# Altium project ISL6236A_DEMO_V1I1.PrjPcb
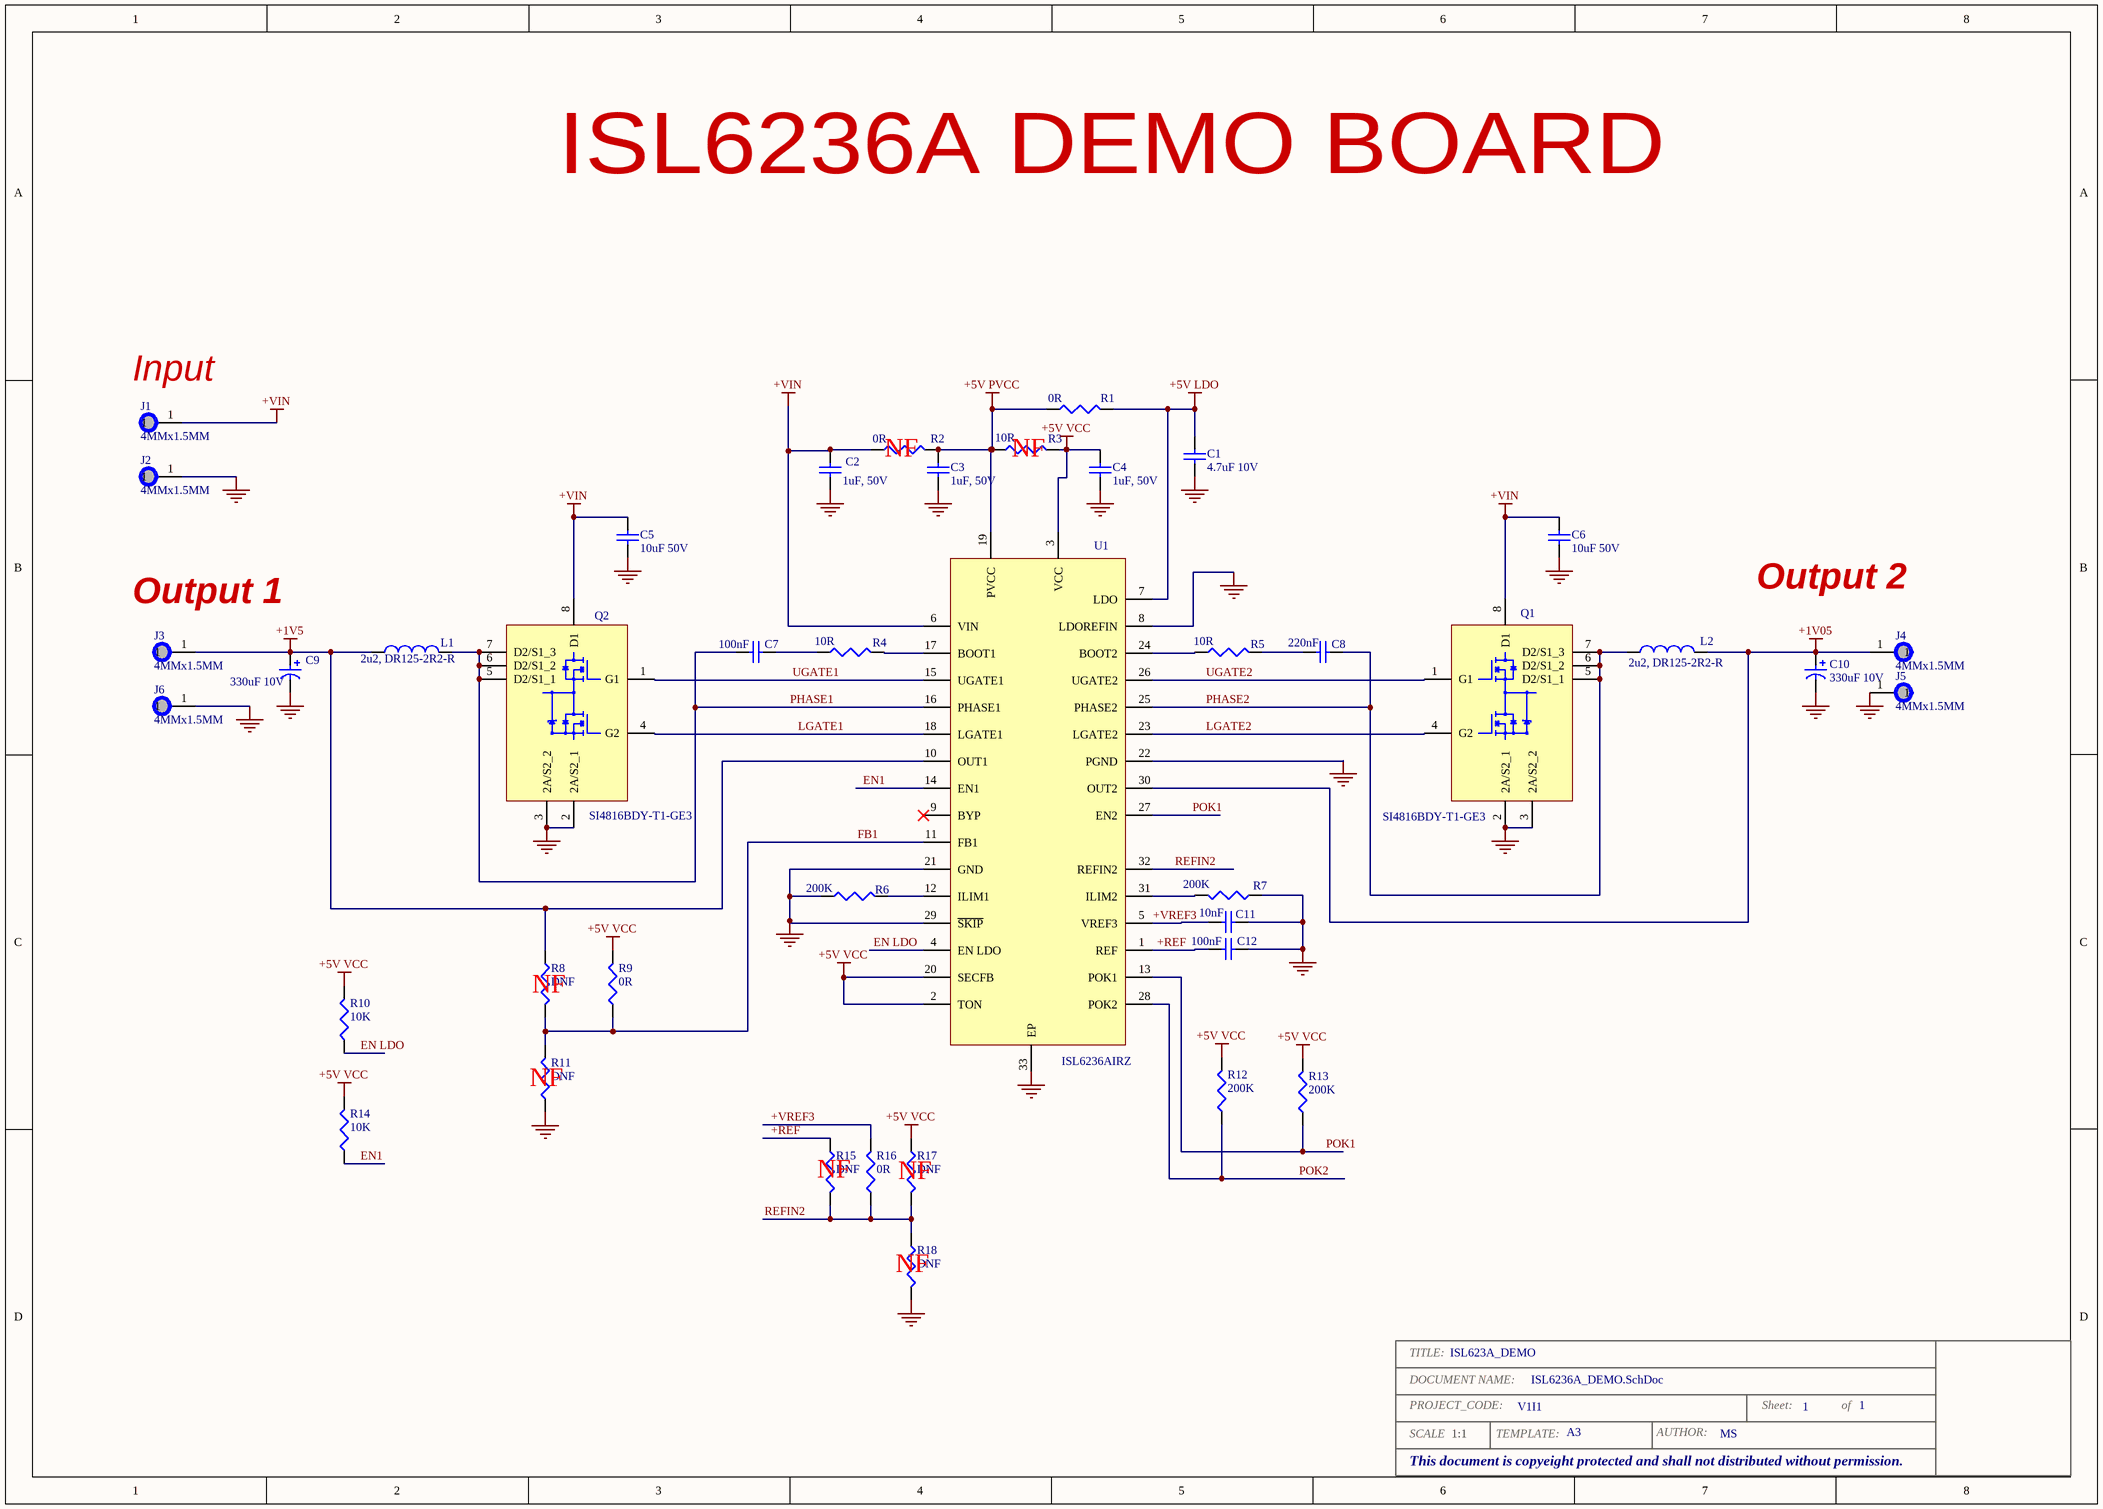
[diagram p0: ISL6236A_DEMO.SchDoc]
1 sheet, 42 parts. Net scope: global (net labels, ports and power ports of the same name join across sheets).
Board file: ISL6236A_DEMO.PcbDoc

## Sheet ISL6236A_DEMO.SchDoc: ISL623A_DEMO
size A3; Author: MS; DocumentNumber: 1; Revision: V1I1; SheetNumber: 1; SheetTotal: 1

### Parts
?  TEMPLATE: A3  (hidden comment: TitleBlock)  (graphical)
C1  4.7uF 10V  [C1210]
C2  1uF, 50V  [C0805]
C3  1uF, 50V  [C0805]
C4  1uF, 50V  [C0805]
C5  10uF 50V  [C1210]
C6  10uF 50V  [C1210]
C7  100nF  [C0805]
C8  220nF  [C0805]
C9  330uF 10V  [7343-43]
C10  330uF 10V  [7343-43]
C11  10nF  [C0805]
C12  100nF  [C0805]
J1  4MMx1.5MM  [PAD_WITH_HOLE_4MMx1.5MM]
J2  4MMx1.5MM  [PAD_WITH_HOLE_4MMx1.5MM]
J3  4MMx1.5MM  [PAD_WITH_HOLE_4MMx1.5MM]
J4  4MMx1.5MM  [PAD_WITH_HOLE_4MMx1.5MM]
J5  4MMx1.5MM  [PAD_WITH_HOLE_4MMx1.5MM]
J6  4MMx1.5MM  [PAD_WITH_HOLE_4MMx1.5MM]
L1  2u2, DR125-2R2-R  [DR125]
L2  2u2, DR125-2R2-R  [DR125]
Q1  SI4816BDY-T1-GE3  [SO-8]
Q2  SI4816BDY-T1-GE3  [SO-8]
R1  0R  [R0805]
R2  0R  [R0805]
R3  10R  [R0805]
R4  10R  [R0805]
R5  10R  [R0805]
R6  200K  [R0805]
R7  200K  [R0805]
R8  DNF  [R0805]
R9  0R  [R0805]
R10  10K  [R0805]
R11  DNF  [R0805]
R12  200K  [R0805]
R13  200K  [R0805]
R14  10K  [R0805]
R15  DNF  [R0805]
R16  0R  [R0805]
R17  DNF  [R0805]
R18  DNF  [R0805]
U1  ISL6236AIRZ  [LL32.5x5B]

### Nets
+1V5: C9.1 J3.1 L1.1 R8.1 U1.10(OUT1)
+1V05: C10.1 J4.1 L2.2 U1.30(OUT2)
+5V LDO: C1.2 R1.2 U1.7(LDO)
+5V PVCC: C3.2 R1.1 R2.2 R3.1 U1.19(PVCC)
+5V VCC: C4.2 R3.2 R9.2 R10.2 R12.2 R13.2 R14.2 R17.1 U1.2(TON) U1.3(VCC) U1.20(SECFB)
+VIN: C2.2 C5.2 C6.2 J1.1 Q1.8(D1) Q2.8(D1) R2.1 U1.6(VIN)
GND: C1.1 C2.1 C3.1 C4.1 C5.1 C6.1 C9.2 C10.2 C11.2 C12.2 J2.1 J5.1 J6.1 Q1.2(2A/S2_1) Q1.3(2A/S2_2) Q2.2(2A/S2_1) Q2.3(2A/S2_2) R6.2 R7.1 R11.1 R18.2 U1.8(LDOREFIN) U1.21(GND) U1.22(PGND) U1.29(~{SKIP}) U1.33(EP)
+REF: C12.1 R15.1 U1.1(REF)
+VREF3: C11.1 R16.2 U1.5(VREF3)
EN1: R14.1 U1.14(EN1)
EN LDO: R10.1 U1.4(EN_LDO)
FB1: R8.2 R9.1 R11.2 U1.11(FB1)
LGATE1: Q2.4(G2) U1.18(LGATE1)
LGATE2: Q1.4(G2) U1.23(LGATE2)
PHASE1: C7.1 L1.2 Q2.5(D2/S1_1) Q2.6(D2/S1_2) Q2.7(D2/S1_3) U1.16(PHASE1)
PHASE2: C8.2 L2.1 Q1.5(D2/S1_1) Q1.6(D2/S1_2) Q1.7(D2/S1_3) U1.25(PHASE2)
POK1: R13.1 U1.13(POK1) U1.27(EN2)
POK2: R12.1 U1.28(POK2)
REFIN2: R15.2 R16.1 R17.2 R18.1 U1.32(REFIN2)
UGATE1: Q2.1(G1) U1.15(UGATE1)
UGATE2: Q1.1(G1) U1.26(UGATE2)
NetC7_2: C7.2 R4.1
NetC8_1: C8.1 R5.2
NetR4_2: R4.2 U1.17(BOOT1)
NetR5_1: R5.1 U1.24(BOOT2)
NetR6_1: R6.1 U1.12(ILIM1)
NetR7_2: R7.2 U1.31(ILIM2)

Not connected (* = marked no-connect by the designer): U1 9(BYP)*

### Notes on the sheet
- ISL6236A DEMO BOARD
- (near J1) Input
- (near R2) NF
- (near R3) NF
- Output 1
- Output 2
- (near R8) NF
- (near R11) NF
- (near R15) NF
- (near R17) NF
- (near R18) NF
- (in symbol TitleBlock) TITLE:; DOCUMENT NAME:; PROJECT_CODE:; Sheet:; of; SCALE; 1:1; TEMPLATE:; AUTHOR:; This document is copyeight protected and shall not distributed without permission.

### Library data of the parts
? = TitleBlock: Standard Title Block
C1 = C3225X7R1H105M/2.00: Cap Ceramic 1uF 50V X7R 20% SMD 1210 125°C Blister T/R; Manufacturer: TDK; Supplier 1: Newark; Manufacturer Part Number: C3225X7R1H105M/2.00; RoHS: Yes; Category: Ceramic Capacitors; Mount: Surface Mount; Case/Package: 1210; Number of Pins: 2; Case Code (Metric): 3225; Case Code (Imperial): 1210; Min Operating Temperature: -55°C; Max Operating Temperature: 125°C; Capacitance: 1uF; Voltage Rating: 50V; Tolerance: 20%; Packaging: Tape and Reel; Dielectric: X7R; Package Quantity: 1; Voltage Rating (DC): 50V; Series: C; Construction: Flat; Length: 0.126inch; Width: 0.098inch; Thickness: 0.087inch; RoHS Compliant: Yes; ComponentLink1URL: https://datasheet.ciiva.com/162/c-series-generalappl-b11-162224.pdf?src-supplier=Digi-Key; ComponentLink1Description: https://datasheet.ciiva.com/162/c-series-generalappl-b11-162224.pdf?src-supplier=Digi-Key; ComponentLink2URL: https://datasheet.ciiva.com/162/c-series-generalappl-b11-162225.pdf?src-supplier=Digi-Key; ComponentLink2Description: https://datasheet.ciiva.com/162/c-series-generalappl-b11-162225.pdf?src-supplier=Digi-Key; ComponentLink3URL: https://datasheet.ciiva.com/162/c-series-generalappl-b11-162223.pdf?src-supplier=Digi-Key; ComponentLink3Description: https://datasheet.ciiva.com/162/c-series-generalappl-b11-162223.pdf?src-supplier=Digi-Key; Supplier Part Number 1: 48T2930
C2-C4 = C2012X7R1H105K125AB: C Series 0805 1 uF 50 V ±10% Tolerance X7R SMT Multilayer Ceramic Capacitor; Manufacturer: TDK; Supplier 1: Newark; Manufacturer Part Number: C2012X7R1H105K125AB; RoHS: Yes; Category: Ceramic Capacitors; Stock 1: 428000; Pricing 1: 1=0.07800, 2000=0.07500, 4000=0.07300 (USD); Mount: Surface Mount; Case/Package: 0805; Number of Pins: 2; Case Code (Metric): 2012; Case Code (Imperial): 0805; Weight: 0.000194oz; Dielectric Material: Ceramic; Min Operating Temperature: -55°C; Max Operating Temperature: 125°C; Packaging: Tape and Reel; Package Quantity: 1; Capacitance: 1uF; Tolerance: 10%; Voltage Rating: 50V; Voltage Rating (DC): 50V; Dielectric: X7R; Termination: SMD/SMT; Resistor Type: Ceramic; Series: C; Construction: Flat; Length: 2mm; Width: 0.049inch; Height: 1.25mm; Thickness: 0.057inch; Depth: 1.25mm; Radiation Hardening: No; REACH SVHC: No SVHC; Lead Free: Lead Free; RoHS Compliant: Yes; ComponentLink1URL: https://datasheet.ciiva.com/22718/1796654-22718037.pdf?src-supplier=Element14; ComponentLink1Description: https://datasheet.ciiva.com/22718/1796654-22718037.pdf?src-supplier=Element14; ComponentLink2URL: https://datasheet.ciiva.com/6274/tdkmlcccaprange-6274890.pdf?src-supplier=Digi-Key; ComponentLink2Description: https://datasheet.ciiva.com/6274/tdkmlcccaprange-6274890.pdf?src-supplier=Digi-Key; ComponentLink3URL: https://datasheet.ciiva.com/23803/1796654-23803036.pdf?src-supplier=Newark; ComponentLink3Description: https://datasheet.ciiva.com/23803/1796654-23803036.pdf?src-supplier=Newark; ComponentLink4URL: https://datasheet.ciiva.com/28673/mlcc-commercial-general-en-28673565.pdf?src-supplier=Element14; ComponentLink4Description: https://datasheet.ciiva.com/28673/mlcc-commercial-general-en-28673565.pdf?src-supplier=Element14; ComponentLink5URL: https://datasheet.ciiva.com/6274/tdkmlcccaprange-6274886.pdf?src-supplier=Digi-Key; ComponentLink5Description: https://datasheet.ciiva.com/6274/tdkmlcccaprange-6274886.pdf?src-supplier=Digi-Key; ComponentLink6URL: https://datasheet.ciiva.com/6274/tdkmlcccaprange-6274888.pdf?src-supplier=Digi-Key; ComponentLink6Description: https://datasheet.ciiva.com/6274/tdkmlcccaprange-6274888.pdf?src-supplier=Digi-Key; ComponentLink7URL: https://datasheet.ciiva.com/24191/general-b11-24191449.pdf?src-supplier=Future+Electronics; ComponentLink7Description: https://datasheet.ciiva.com/24191/general-b11-24191449.pdf?src-supplier=Future+Electronics; Supplier Part Number 1: 79Y4372
C5 C6 = UMK325BJ106MM-T: Multilayer Ceramic Capacitors (High dielectric type), 50V, 10 uF, ± 20 %, 1210, X5R, RoHS; Manufacturer: Taiyo Yuden; Tolerance: 20%; Supplier 1: Avnet; Manufacturer Part Number: UMK325BJ106MM-T; RoHS: Yes; Category: Ceramic Capacitors; Stock 1: 1500; Pricing 1: 500=0.25400, 1000=0.23400, 2000=0.22800, 3000=0.22100, 5000=0.21000 (USD); Mount: Surface Mount; Case/Package: 1210; Number of Pins: 2; Case Code (Metric): 3225; Case Code (Imperial): 1210; Contact Plating: Nickel; Min Operating Temperature: -55°C; Max Operating Temperature: 85°C; Capacitance: 10uF; Packaging: Tape and Reel; Voltage Rating (DC): 50V; Dielectric: X5R; Package Quantity: 500; Voltage Rating: 50V; Termination: SMD/SMT; Voltage: 50V; Series: M; Construction: Flat; Length: 3.2mm; Width: 0.098inch; Height: 2.5mm; Thickness: 0.106inch; Depth: 2.5mm; Radiation Hardening: No; Lead Free: Lead Free; Halogen Free: Halogen Free; REACH SVHC: No SVHC; RoHS Compliant: Yes; ComponentLink1URL: https://datasheet.ciiva.com/141/umk325bj106mm-t-ss-141730.pdf?src-supplier=Digi-Key; ComponentLink1Description: https://datasheet.ciiva.com/141/umk325bj106mm-t-ss-141730.pdf?src-supplier=Digi-Key; ComponentLink2URL: https://datasheet.ciiva.com/15922/1153umk325bj106mm-t-15922661.pdf?src-supplier=Onlinecomponents.com; ComponentLink2Description: https://datasheet.ciiva.com/15922/1153umk325bj106mm-t-15922661.pdf?src-supplier=Onlinecomponents.com; ComponentLink3URL: https://datasheet.ciiva.com/11601/umk325bj106mm-t-ss-11601831.pdf?src-supplier=Avnet; ComponentLink3Description: https://datasheet.ciiva.com/11601/umk325bj106mm-t-ss-11601831.pdf?src-supplier=Avnet; ComponentLink4URL: https://datasheet.ciiva.com/30172/998umk325bj106mm-t-30172061.pdf?src-supplier=Onlinecomponents.com; ComponentLink4Description: https://datasheet.ciiva.com/30172/998umk325bj106mm-t-30172061.pdf?src-supplier=Onlinecomponents.com; ComponentLink5URL: https://datasheet.ciiva.com/7975/1497285-7975925.pdf?src-supplier=Element14; ComponentLink5Description: https://datasheet.ciiva.com/7975/1497285-7975925.pdf?src-supplier=Element14; ComponentLink6URL: https://datasheet.ciiva.com/7975/mlcc-all-e-7975926.pdf?src-supplier=Element14; ComponentLink6Description: https://datasheet.ciiva.com/7975/mlcc-all-e-7975926.pdf?src-supplier=Element14; ComponentLink7URL: https://datasheet.ciiva.com/5745/mlcc-all-e-5745129.pdf?src-supplier=Farnell; ComponentLink7Description: https://datasheet.ciiva.com/5745/mlcc-all-e-5745129.pdf?src-supplier=Farnell; ComponentLink8URL: https://datasheet.ciiva.com/5744/1497285-5744924.pdf?src-supplier=Farnell; ComponentLink8Description: https://datasheet.ciiva.com/5744/1497285-5744924.pdf?src-supplier=Farnell; Supplier Part Number 1: 61M4721
C7 C12 = C2012X7R1H104K085AA: C Series 0805 0.1 uF 50 V ±10 % Tolerance X7R SMT Multilayer Ceramic Capacitor; Manufacturer: TDK; Voltage Rating: 50V; Tolerance: 10%; Supplier 1: Digi-Key; Manufacturer Part Number: C2012X7R1H104K085AA; RoHS: Yes; Category: Ceramic Capacitors; Stock 1: 4695; Pricing 1: 1=0.15000, 10=0.10400, 50=0.05900, 100=0.04880, 500=0.03422, 1000=0.02833 (USD); Mount: Surface Mount; Case/Package: 0805; Number of Pins: 2; Case Code (Metric): 2012; Case Code (Imperial): 0805; Weight: 0.000194oz; Dielectric Material: Ceramic; Min Operating Temperature: -55°C; Max Operating Temperature: 125°C; Package Quantity: 1; Packaging: Tape and Reel; Capacitance: 100nF; Voltage Rating (DC): 50V; Dielectric: X7R; Termination: SMD/SMT; Resistor Type: Ceramic; Voltage: 50V; Series: C; Construction: Flat; Length: 2mm; Width: 0.049inch; Height: 0.85mm; Thickness: 0.037inch; Depth: 1.25mm; Radiation Hardening: No; REACH SVHC: No SVHC; Lead Free: Lead Free; RoHS Compliant: Yes; ComponentLink1URL: https://datasheet.ciiva.com/11788/0900766b80c1bb00-11788128.pdf?src-supplier=RSComponents; ComponentLink1Description: https://datasheet.ciiva.com/11788/0900766b80c1bb00-11788128.pdf?src-supplier=RSComponents; ComponentLink2URL: https://datasheet.ciiva.com/6250/tdkmlcccaprange-6250821.pdf?src-supplier=Digi-Key; ComponentLink2Description: https://datasheet.ciiva.com/6250/tdkmlcccaprange-6250821.pdf?src-supplier=Digi-Key; ComponentLink3URL: https://datasheet.ciiva.com/24191/e412-c-24191447.pdf?src-supplier=Future+Electronics; ComponentLink3Description: https://datasheet.ciiva.com/24191/e412-c-24191447.pdf?src-supplier=Future+Electronics; ComponentLink4URL: https://datasheet.ciiva.com/6250/tdkmlcccaprange-6250824.pdf?src-supplier=Digi-Key; ComponentLink4Description: https://datasheet.ciiva.com/6250/tdkmlcccaprange-6250824.pdf?src-supplier=Digi-Key; ComponentLink5URL: https://datasheet.ciiva.com/23803/1796654-23803035.pdf?src-supplier=Newark; ComponentLink5Description: https://datasheet.ciiva.com/23803/1796654-23803035.pdf?src-supplier=Newark; ComponentLink6URL: https://datasheet.ciiva.com/28602/1571323-28602204.pdf?src-supplier=Element14; ComponentLink6Description: https://datasheet.ciiva.com/28602/1571323-28602204.pdf?src-supplier=Element14; Supplier Part Number 1: 445-7534-1-ND
C8 = C2012X7R1H224K125AA: CERAMIC CAPACITOR 0.22UF, 50V, X7R, 10%, 0805, FULL REEL; Product Range:C Series; Capacitance:0.22 F; Capacitance Tolerance:  10%; Dielectric Characteristic:X7R; Voltage Rating:50V; Ceramic Capacitor Case:0805 ^2012 Metric]; MSL:-; Manufacturer: TDK; Supplier 1: Digi-Key; Manufacturer Part Number: C2012X7R1H224K125AA; RoHS: Yes; Category: Ceramic Capacitors; Stock 1: 191329; Pricing 1: 1=0.16000, 10=0.11600, 50=0.06580, 100=0.05450, 500=0.03824, 1000=0.03166 (USD); Mount: Surface Mount; Case/Package: 0805; Number of Pins: 2; Case Code (Metric): 2012; Case Code (Imperial): 0805; Weight: 0.000194oz; Dielectric Material: Ceramic; Min Operating Temperature: -55°C; Max Operating Temperature: 125°C; Capacitance: 220nF; Voltage Rating: 50V; Tolerance: 10%; Packaging: Tape and Reel; Package Quantity: 1; Voltage Rating (DC): 50V; Dielectric: X7R; Termination: SMD/SMT; Resistor Type: Ceramic; Voltage: 50V; Series: C; Construction: Flat; Length: 2mm; Width: 0.049inch; Height: 1.25mm; Thickness: 0.057inch; Depth: 1.25mm; Radiation Hardening: No; REACH SVHC: No SVHC; Lead Free: Lead Free; RoHS Compliant: Yes; ComponentLink1URL: https://datasheet.ciiva.com/11788/0900766b80c1bb00-11788127.pdf?src-supplier=RSComponents; ComponentLink1Description: https://datasheet.ciiva.com/11788/0900766b80c1bb00-11788127.pdf?src-supplier=RSComponents; ComponentLink2URL: https://datasheet.ciiva.com/17487/e412-c-17487255.pdf?src-supplier=Avnet+Europe; ComponentLink2Description: https://datasheet.ciiva.com/17487/e412-c-17487255.pdf?src-supplier=Avnet+Europe; ComponentLink3URL: https://datasheet.ciiva.com/6292/tdkmlcccaprange-6292269.pdf?src-supplier=Digi-Key; ComponentLink3Description: https://datasheet.ciiva.com/6292/tdkmlcccaprange-6292269.pdf?src-supplier=Digi-Key; ComponentLink4URL: https://datasheet.ciiva.com/16427/e412-c-16427832.pdf?src-supplier=Future+Electronics; ComponentLink4Description: https://datasheet.ciiva.com/16427/e412-c-16427832.pdf?src-supplier=Future+Electronics; ComponentLink5URL: https://datasheet.ciiva.com/28602/1571323-28602205.pdf?src-supplier=Element14; ComponentLink5Description: https://datasheet.ciiva.com/28602/1571323-28602205.pdf?src-supplier=Element14; Supplier Part Number 1: 445-1350-1-ND
C9 C10 = T530X337M010ATE004: Cap Tant Solid 330uF 10V X CASE 20% (7.3 X 4.3 X 4mm) SMD 7343-43 0.004 Ohm 125 C T/R; Manufacturer: KEMET; ESR (Equivalent Series Resistance): 4mR; Leakage Current: 330uA; Polarity: Polar; Dissipation Factor: 8%; Ripple Current: 8.2A; Life (Hours): 2000Hour; Supplier 1: Digi-Key; Manufacturer Part Number: T530X337M010ATE004; RoHS: Yes; Category: Polymer Capacitors; Stock 1: 41; Pricing 1: 1=8.13000, 10=7.23000, 50=6.32620, 100=5.78400 (USD); Mount: Surface Mount,PCB; Case/Package: 2917; Case Code (Imperial): 2917; Case Code (Metric): 7343; Min Operating Temperature: -55°C; Max Operating Temperature: 125°C; Capacitance: 330uF; Tolerance: 20%; Package Quantity: 500; Voltage Rating (DC): 10V; Packaging: Tape and Reel; Voltage Rating: 10V; Termination: SMD/SMT; Features: General Purpose; Series: T530; Construction: Flat; Voltage: 10V; Length: 7.3mm; Width: 4.3mm; Height: 4mm; Depth: 4.3mm; Height - Seated (Max): 0.169inch; REACH SVHC: No SVHC; RoHS Compliant: Yes; ComponentLink1URL: https://datasheet.ciiva.com/11794/0900766b80deaa91-11794477.pdf?src-supplier=RSComponents; ComponentLink1Description: https://datasheet.ciiva.com/11794/0900766b80deaa91-11794477.pdf?src-supplier=RSComponents; ComponentLink2URL: https://datasheet.ciiva.com/14593/70096008-14593753.pdf?src-supplier=Allied+Electronics; ComponentLink2Description: https://datasheet.ciiva.com/14593/70096008-14593753.pdf?src-supplier=Allied+Electronics; Supplier Part Number 1: 399-10378-1-ND
C11 = VJ0805Y103KNAAO: 0805 VJ 10nF Ceramic Multilayer Capacitor; 50V; +105C; X7R Dielectric; +/-10% SMD; Manufacturer: Vishay Vitramon; Tolerance: 10%; Supplier 1: Digi-Key; Manufacturer Part Number: VJ0805Y103KNAAO; RoHS: Yes; Category: Ceramic Capacitors; Stock 1: 1009; Pricing 1: 1=0.67000, 10=0.41200, 50=0.29580, 100=0.25580, 500=0.18218, 1000=0.15504 (USD); Mount: Surface Mount; Case/Package: 0805; Case Code (Metric): 2012; Case Code (Imperial): 0805; Min Operating Temperature: -55°C; Max Operating Temperature: 125°C; Packaging: Tape and Reel; Capacitance: 10nF; Package Quantity: 1; Voltage Rating: 50V; Voltage Rating (DC): 50V; Dielectric: X7R; Termination: SMD/SMT; Voltage: 50V; Series: VJ; Construction: Flat; Length: 2mm; Width: 0.049inch; Height: 1.45mm; Thickness: 0.057inch; Depth: 1.25mm; Radiation Hardening: No; REACH SVHC: Unknown; RoHS Compliant: Yes; ComponentLink1URL: https://datasheet.ciiva.com/25613/0900766b8104796c-25613141.pdf?src-supplier=RSComponents; ComponentLink1Description: https://datasheet.ciiva.com/25613/0900766b8104796c-25613141.pdf?src-supplier=RSComponents; ComponentLink2URL: https://datasheet.ciiva.com/148/nonmagneticepoxybond-148342.pdf?src-supplier=Digi-Key; ComponentLink2Description: https://datasheet.ciiva.com/148/nonmagneticepoxybond-148342.pdf?src-supplier=Digi-Key; ComponentLink3URL: https://datasheet.ciiva.com/148/nonmagneticepoxybond-148343.pdf?src-supplier=Digi-Key; ComponentLink3Description: https://datasheet.ciiva.com/148/nonmagneticepoxybond-148343.pdf?src-supplier=Digi-Key; ComponentLink4URL: https://datasheet.ciiva.com/148/nonmagneticepoxybond-148344.pdf?src-supplier=Digi-Key; ComponentLink4Description: https://datasheet.ciiva.com/148/nonmagneticepoxybond-148344.pdf?src-supplier=Digi-Key; ComponentLink5URL: https://datasheet.ciiva.com/46417/1805046-46417853.pdf?src-supplier=Element14; ComponentLink5Description: https://datasheet.ciiva.com/46417/1805046-46417853.pdf?src-supplier=Element14; ComponentLink6URL: https://datasheet.ciiva.com/46417/1805046-46417854.pdf?src-supplier=Element14; ComponentLink6Description: https://datasheet.ciiva.com/46417/1805046-46417854.pdf?src-supplier=Element14; Supplier Part Number 1: 720-1244-1-ND
J1-J6 = PAD_WITH_HOLE_4MMx1.5MM: Pad with a hole 4mm x 1.5mm
L1 L2 = DR125-2R2-R: FIXED IND 2.2UH 10.9A 4.5 MOHM; Manufacturer: Eaton Cooper; Core Material: Ferrite; Saturation Current: 15A; Tolerance: 20%; Shielding: Shielded; DC Resistance (DCR): 4.5mR; Test Frequency: 100kHz; Supplier 1: Digi-Key; Manufacturer Part Number: DR125-2R2-R; RoHS: Yes; Category: Fixed Inductors; Pricing 1: 1=1.35000, 10=1.25100, 25=1.15520, 50=0.96240, 100=0.90480, 250=0.80848 (USD); Mount: Surface Mount; Case/Package: Nonstandard; Number of Pins: 2; Weight: 0.144oz; Min Operating Temperature: -40°C; Max Operating Temperature: 125°C; Package Quantity: 600; Current Rating: 10.9A; Packaging: Tape and Reel; Inductance: 2.2uH; Inductance Tolerance: 20%; Resistor Type: Wirewound; Max DC Current: 10.9A; Termination: SMD/SMT; Self Resonant Frequency: 100kHz; DC Current: 10.9A; RMS Current (Irms): 10.9A; Series: DR; Rated Current-Max: 10.9A; Length: 12.5mm; Width: 0.492inch; Height: 6mm; Height - Seated (Max): 0.236inch; Depth: 12.5mm; Radiation Hardening: No; REACH SVHC: No SVHC; Military Standard: Not; Lead Free: Lead Free; RoHS Compliant: Yes; ComponentLink1URL: https://datasheet.ciiva.com/14667/0900766b8116a153-14667792.pdf?src-supplier=RSComponents; ComponentLink1Description: https://datasheet.ciiva.com/14667/0900766b8116a153-14667792.pdf?src-supplier=RSComponents; ComponentLink2URL: https://datasheet.ciiva.com/26926/getdatasheetpartid-571249-26926912.pdf?src-supplier=Verical; ComponentLink2Description: https://datasheet.ciiva.com/26926/getdatasheetpartid-571249-26926912.pdf?src-supplier=Verical; ComponentLink3URL: https://datasheet.ciiva.com/8004/87246-8004874.pdf?src-supplier=Element14; ComponentLink3Description: https://datasheet.ciiva.com/8004/87246-8004874.pdf?src-supplier=Element14; Supplier Part Number 1: 513-1662-1-ND
Q1 Q2 = SI4816BDY-T1-GE3: Transistor MOSFET Array Dual N-CH 30V 5.8A/8.2A 8-Pin SOIC T/R; Manufacturer: Vishay Siliconix; Rise Time: 9ns; Rds On Max: 18.5mR; Gate to Source Voltage (Vgs): 20V; Continuous Drain Current (ID): 5.8A; Drain to Source Resistance: 9.3mR; Max Power Dissipation: 1.25W; Turn-Off Delay Time: 31ns; Turn-On Delay Time: 13ns; Number of Elements: 2; Threshold Voltage: 3V; FET Type: 2 N-Channel; Polarity: N-CHANNEL; Supplier 1: Digi-Key; Manufacturer Part Number: SI4816BDY-T1-GE3; RoHS: Yes; Category: MOSFETs; Pricing 1: 1=1.72000, 10=1.54500, 100=1.24180, 500=1.02024, 1000=0.87450 (USD); Mount: Surface Mount; Case/Package: SO; Number of Pins: 8; Weight: 0.006596oz; Contact Plating: Tin,Matte; Min Operating Temperature: -55°C; Max Operating Temperature: 150°C; Packaging: Tape and Reel; Package Quantity: 1; Drain to Source Voltage (Vdss): 30V; Fall Time: 9ns; Number of Channels: 2; On-State Resistance: 18.5mR; Series: LITTLE FOOT®; Drain-source On Resistance-Max: 18.5mR; Length: 5mm; Width: 4mm; Height: 1.55mm; Radiation Hardening: No; REACH SVHC: No SVHC; Lead Free: Lead Free; RoHS Compliant: Yes; ComponentLink1URL: https://datasheet.ciiva.com/26789/si4816bdy-t1-ge3-26789227.pdf?src-supplier=IIIC; ComponentLink1Description: https://datasheet.ciiva.com/26789/si4816bdy-t1-ge3-26789227.pdf?src-supplier=IIIC; ComponentLink2URL: https://datasheet.ciiva.com/7710/si4816bd-7710215.pdf?src-supplier=Element14; ComponentLink2Description: https://datasheet.ciiva.com/7710/si4816bd-7710215.pdf?src-supplier=Element14; ComponentLink3URL: https://datasheet.ciiva.com/24158/si4816bd-24158215.pdf?src-supplier=Future+Electronics; ComponentLink3Description: https://datasheet.ciiva.com/24158/si4816bd-24158215.pdf?src-supplier=Future+Electronics; ComponentLink4URL: https://datasheet.ciiva.com/928/si4816bd-928461.pdf?src-supplier=Digi-Key; ComponentLink4Description: https://datasheet.ciiva.com/928/si4816bd-928461.pdf?src-supplier=Digi-Key; ComponentLink5URL: https://datasheet.ciiva.com/928/si4816bd-928462.pdf?src-supplier=Digi-Key; ComponentLink5Description: https://datasheet.ciiva.com/928/si4816bd-928462.pdf?src-supplier=Digi-Key; ComponentLink6URL: https://datasheet.ciiva.com/11160/si4816bd-11160494.pdf?src-supplier=Avnet; ComponentLink6Description: https://datasheet.ciiva.com/11160/si4816bd-11160494.pdf?src-supplier=Avnet; ComponentLink7URL: https://datasheet.ciiva.com/928/si4816bd-928463.pdf?src-supplier=Digi-Key; ComponentLink7Description: https://datasheet.ciiva.com/928/si4816bd-928463.pdf?src-supplier=Digi-Key; ComponentLink8URL: https://datasheet.ciiva.com/22707/1911984-22707813.pdf?src-supplier=Element14; ComponentLink8Description: https://datasheet.ciiva.com/22707/1911984-22707813.pdf?src-supplier=Element14; Supplier Part Number 1: SI4816BDY-T1-GE3CT-ND
R1 R2 R9 R16 = ERJ-6GEY0R00V: Resistor Thick Film 0805 0 Ohm 1-8w Surface Mount Embossed Carrier Tape and Reel; Manufacturer: Panasonic; Voltage Rating: 150V; Power Rating: 125mW; Tolerance: 5%; Temperature Coefficient: 600ppm/°C; Current Rating: 2A; Supplier 1: RSComponents; Manufacturer Part Number: ERJ-6GEY0R00V; RoHS: Yes; Category: Chip SMD Resistors; Stock 1: 1075000; Pricing 1: 5000=0.00900, 10000=0.00800, 15000=0.00800, 20000=0.00800 (USD); Mount: Surface Mount; Case/Package: 0805; Contact Plating: Tin; Case Code (Imperial): 0805; Case Code (Metric): 2012; Min Operating Temperature: -55°C; Max Operating Temperature: 155°C; Resistance: 0R; Resistor Type: Thick Film; Packaging: Tape and Reel; Package Quantity: 1; Termination: SMD/SMT; Number of Terminations: 2; Max Power Dissipation: 125mW; Voltage Rating (DC): 150V; Series: ERJ; Technology: THICK FILM; Construction: Rectangular; Features: Automotive AEC-Q200; Length: 2mm; Width: 1.25mm; Height: 0.6mm; Depth: 1.25mm; Radiation Hardening: No; Military Standard: Not; Lead Free: Lead Free; RoHS Compliant: Yes; REACH SVHC: No SVHC; ComponentLink1URL: https://datasheet.ciiva.com/36526/1989607-36526237.pdf?src-supplier=Jameco; ComponentLink1Description: https://datasheet.ciiva.com/36526/1989607-36526237.pdf?src-supplier=Jameco; ComponentLink2URL: https://datasheet.ciiva.com/11821/0900766b80f806dd-11821735.pdf?src-supplier=RSComponents; ComponentLink2Description: https://datasheet.ciiva.com/11821/0900766b80f806dd-11821735.pdf?src-supplier=RSComponents; ComponentLink3URL: https://datasheet.ciiva.com/43460/1678796-43460073.pdf?src-supplier=Farnell; ComponentLink3Description: https://datasheet.ciiva.com/43460/1678796-43460073.pdf?src-supplier=Farnell; ComponentLink4URL: https://datasheet.ciiva.com/46377/1678796-46377866.pdf?src-supplier=Element14; ComponentLink4Description: https://datasheet.ciiva.com/46377/1678796-46377866.pdf?src-supplier=Element14; ComponentLink5URL: https://datasheet.ciiva.com/28695/1678796-28695877.pdf?src-supplier=Element14; ComponentLink5Description: https://datasheet.ciiva.com/28695/1678796-28695877.pdf?src-supplier=Element14; ComponentLink6URL: https://datasheet.ciiva.com/9117/aoa0000ce1-9117354.pdf?src-supplier=Avnet; ComponentLink6Description: https://datasheet.ciiva.com/9117/aoa0000ce1-9117354.pdf?src-supplier=Avnet; ComponentLink7URL: https://datasheet.ciiva.com/17215/aoa0000ce1-17215390.pdf?src-supplier=Avnet+Europe; ComponentLink7Description: https://datasheet.ciiva.com/17215/aoa0000ce1-17215390.pdf?src-supplier=Avnet+Europe; ComponentLink8URL: https://datasheet.ciiva.com/16512/aoa0000ce1-16512111.pdf?src-supplier=Avnet+Asia; ComponentLink8Description: https://datasheet.ciiva.com/16512/aoa0000ce1-16512111.pdf?src-supplier=Avnet+Asia; Supplier Part Number 1: 7326514
R3-R5 = ERJ-6GEYJ100V: Resistor Thick Film 0805 10 Ohm 5% 1/8W 200ppm/C Molded SMD Punched Carrier T/R; Manufacturer: Panasonic; Voltage Rating (DC): 150V; Power Rating: 125mW; Temperature Coefficient: 200ppm/°C; Supplier 1: Newark; Manufacturer Part Number: ERJ-6GEYJ100V; RoHS: Yes; Category: Chip SMD Resistors; Stock 1: 605000; Pricing 1: 1=0.01000, 5000=0.01000 (USD); Mount: Surface Mount; Case/Package: 0805; Case Code (Metric): 2012; Case Code (Imperial): 0805; Contact Plating: Tin; Min Operating Temperature: -55°C; Max Operating Temperature: 155°C; Packaging: Tape and Reel; Package Quantity: 5000; Series: ERJ; Resistance: 10R; Tolerance: 5%; Voltage Rating: 150V; Resistor Type: Thick Film; Number of Terminations: 2; Termination: SMD/SMT; Max Power Dissipation: 125mW; Technology: THICK FILM; Resistance Tolerance: 5%; Construction: Rectangular; Working Voltage: 150V; Length: 2mm; Width: 0.049inch; Height: 0.6mm; Depth: 1.25mm; Radiation Hardening: No; Lead Free: Lead Free; RoHS Compliant: Yes; REACH SVHC: No SVHC; Military Standard: Not; ComponentLink1URL: https://datasheet.ciiva.com/34303/1989615-34303646.pdf?src-supplier=Jameco; ComponentLink1Description: https://datasheet.ciiva.com/34303/1989615-34303646.pdf?src-supplier=Jameco; ComponentLink2URL: https://datasheet.ciiva.com/11821/0900766b80f806dd-11821499.pdf?src-supplier=RSComponents; ComponentLink2Description: https://datasheet.ciiva.com/11821/0900766b80f806dd-11821499.pdf?src-supplier=RSComponents; ComponentLink3URL: https://datasheet.ciiva.com/43460/1500035-43460079.pdf?src-supplier=Farnell; ComponentLink3Description: https://datasheet.ciiva.com/43460/1500035-43460079.pdf?src-supplier=Farnell; ComponentLink4URL: https://datasheet.ciiva.com/46388/1500035-46388637.pdf?src-supplier=Element14; ComponentLink4Description: https://datasheet.ciiva.com/46388/1500035-46388637.pdf?src-supplier=Element14; ComponentLink5URL: https://datasheet.ciiva.com/16788/70255313-16788828.pdf?src-supplier=Allied+Electronics; ComponentLink5Description: https://datasheet.ciiva.com/16788/70255313-16788828.pdf?src-supplier=Allied+Electronics; ComponentLink6URL: https://datasheet.ciiva.com/16775/70255313-16775163.pdf?src-supplier=Allied+Electronics; ComponentLink6Description: https://datasheet.ciiva.com/16775/70255313-16775163.pdf?src-supplier=Allied+Electronics; ComponentLink7URL: https://datasheet.ciiva.com/9117/aoa0000ce1-9117358.pdf?src-supplier=Avnet; ComponentLink7Description: https://datasheet.ciiva.com/9117/aoa0000ce1-9117358.pdf?src-supplier=Avnet; ComponentLink8URL: https://datasheet.ciiva.com/15158/getdatasheetpartid-247141-15158885.pdf?src-supplier=Verical; ComponentLink8Description: https://datasheet.ciiva.com/15158/getdatasheetpartid-247141-15158885.pdf?src-supplier=Verical; ComponentLink9URL: https://datasheet.ciiva.com/17212/aoa0000ce1-17212058.pdf?src-supplier=Avnet+Europe; ComponentLink9Description: https://datasheet.ciiva.com/17212/aoa0000ce1-17212058.pdf?src-supplier=Avnet+Europe; Supplier Part Number 1: 81AC8591
R6 R7 R12 R13 = ERJ-6ENF2003V: Res Thick Film 0805 200K Ohm 1% 1/8W ±100ppm/°C Molded SMD Punched Carrier T/R; Manufacturer: Panasonic; Power Rating: 125mW; Voltage Rating: 150V; Resistance: 200kR; Supplier 1: Digi-Key; Manufacturer Part Number: ERJ-6ENF2003V; RoHS: Yes; Category: Chip SMD Resistors; Stock 1: 39039; Pricing 1: 5000=0.01169 (USD); Mount: Surface Mount; Case/Package: 0805; Case Code (Imperial): 0805; Case Code (Metric): 2012; Contact Plating: Tin; Size Code: 0805; Min Operating Temperature: -55°C; Max Operating Temperature: 155°C; Tolerance: 1%; Packaging: Tape and Reel; Package Quantity: 1; Termination: SMD/SMT; Resistor Type: Thick Film; Number of Terminations: 2; Temperature Coefficient: 100ppm/°C; Max Power Dissipation: 125mW; Voltage Rating (DC): 150V; Features: Automotive AEC-Q200; Series: ERJ; Technology: THICK FILM; Construction: Rectangular; Resistance Tolerance: 1%; Length: 2mm; Width: 1.2mm; Height: 0.6mm; Depth: 1.25mm; Radiation Hardening: No; REACH SVHC: No SVHC; Military Standard: Not; Lead Free: Lead Free; RoHS Compliant: Yes; ComponentLink1URL: https://datasheet.ciiva.com/3883/3984280s8821682n1386-3883650.pdf?src-supplier=Arrow+Electronics; ComponentLink1Description: https://datasheet.ciiva.com/3883/3984280s8821682n1386-3883650.pdf?src-supplier=Arrow+Electronics; ComponentLink2URL: https://datasheet.ciiva.com/11821/0900766b80f80784-11821569.pdf?src-supplier=RSComponents; ComponentLink2Description: https://datasheet.ciiva.com/11821/0900766b80f80784-11821569.pdf?src-supplier=RSComponents; ComponentLink3URL: https://datasheet.ciiva.com/5868/426256-5868186.pdf?src-supplier=Farnell; ComponentLink3Description: https://datasheet.ciiva.com/5868/426256-5868186.pdf?src-supplier=Farnell; ComponentLink4URL: https://datasheet.ciiva.com/46374/426256-46374223.pdf?src-supplier=Element14; ComponentLink4Description: https://datasheet.ciiva.com/46374/426256-46374223.pdf?src-supplier=Element14; ComponentLink5URL: https://datasheet.ciiva.com/28577/1678782-28577790.pdf?src-supplier=Element14; ComponentLink5Description: https://datasheet.ciiva.com/28577/1678782-28577790.pdf?src-supplier=Element14; ComponentLink6URL: https://datasheet.ciiva.com/28675/1678782-28675835.pdf?src-supplier=Element14; ComponentLink6Description: https://datasheet.ciiva.com/28675/1678782-28675835.pdf?src-supplier=Element14; ComponentLink7URL: https://datasheet.ciiva.com/24070/aoa0000ce2-24070837.pdf?src-supplier=Mouser; ComponentLink7Description: https://datasheet.ciiva.com/24070/aoa0000ce2-24070837.pdf?src-supplier=Mouser; ComponentLink8URL: https://datasheet.ciiva.com/16427/aoa0000ce2-16427100.pdf?src-supplier=Future+Electronics; ComponentLink8Description: https://datasheet.ciiva.com/16427/aoa0000ce2-16427100.pdf?src-supplier=Future+Electronics; ComponentLink9URL: https://datasheet.ciiva.com/30251/aoa0000ce2-30251689.pdf?src-supplier=Onlinecomponents.com; ComponentLink9Description: https://datasheet.ciiva.com/30251/aoa0000ce2-30251689.pdf?src-supplier=Onlinecomponents.com; Supplier Part Number 1: P200KCTR-ND
R8 R11 R15 R17 R18 = RES
R10 R14 = ERJ-6GEYJ103V: Resistor Thick Film 0805 10K Ohm 5% 1/8W 200ppm/C Molded SMD Punched Carrier T/R; Manufacturer: Panasonic; Resistance: 10kR; Power Rating: 125mW; Voltage Rating: 150V; Temperature Coefficient: 200ppm/°C; Supplier 1: Digi-Key; Manufacturer Part Number: ERJ-6GEYJ103V; RoHS: Yes; Category: Chip SMD Resistors; Stock 1: 800131; Pricing 1: 5000=0.00902 (USD); Mount: Surface Mount; Case/Package: 0805; Case Code (Metric): 2012; Case Code (Imperial): 0805; Contact Plating: Tin; Size Code: 0805; Min Operating Temperature: -55°C; Max Operating Temperature: 155°C; Tolerance: 5%; Packaging: Tape and Reel; Package Quantity: 5000; Resistor Type: Thick Film; Number of Terminations: 2; Termination: SMD/SMT; Max Power Dissipation: 125mW; Voltage Rating (DC): 150V; Series: ERJ; Technology: THICK FILM; Resistance Tolerance: 5%; Construction: Rectangular; Features: Automotive AEC-Q200; Length: 2mm; Width: 0.049inch; Height: 0.6mm; Depth: 1.25mm; Radiation Hardening: No; REACH SVHC: No SVHC; Military Standard: Not; Lead Free: Lead Free; RoHS Compliant: Yes; ComponentLink1URL: https://datasheet.ciiva.com/43460/1500035-43460125.pdf?src-supplier=Farnell; ComponentLink1Description: https://datasheet.ciiva.com/43460/1500035-43460125.pdf?src-supplier=Farnell; ComponentLink2URL: https://datasheet.ciiva.com/46386/1500035-46386469.pdf?src-supplier=Element14; ComponentLink2Description: https://datasheet.ciiva.com/46386/1500035-46386469.pdf?src-supplier=Element14; ComponentLink3URL: https://datasheet.ciiva.com/22785/1500035-22785957.pdf?src-supplier=Farnell; ComponentLink3Description: https://datasheet.ciiva.com/22785/1500035-22785957.pdf?src-supplier=Farnell; ComponentLink4URL: https://datasheet.ciiva.com/28514/1678796-28514236.pdf?src-supplier=Element14; ComponentLink4Description: https://datasheet.ciiva.com/28514/1678796-28514236.pdf?src-supplier=Element14; Supplier Part Number 1: P10KATR-ND
U1 = ISL6236AIRZ: Soft Sw PWM Cntrlr 2-OUT Power Supply Controller 200KHz/300KHz/400KHz/500KHz 32-Pin QFN EP; Manufacturer: Intersil; Number of Outputs: 4; Output Current: 20A; Switching Frequency: 500kHz; Supplier 1: Avnet; Manufacturer Part Number: ISL6236AIRZ; RoHS: Yes; Category: Voltage Regulators - Switching; Pricing 1: 600=3.35800, 720=3.28900, 1320=3.22000, 3000=3.15100, 6000=3.08200, 30000=3.01300, 60000=2.94400 (USD); Mount: Surface Mount; Case/Package: QFN; Min Operating Temperature: -40°C; Max Operating Temperature: 100°C; Packaging: Rail/Tube; Package Quantity: 60; Length: 5mm; Width: 5mm; Height: 0.95mm; Radiation Hardening: No; RoHS Compliant: Yes; Lead Free: Lead Free; ComponentLink1URL: https://datasheet.ciiva.com/25905/fn6453-25905351.pdf?src-supplier=Avnet+Europe; ComponentLink1Description: https://datasheet.ciiva.com/25905/fn6453-25905351.pdf?src-supplier=Avnet+Europe; Supplier Part Number 1: ISL6236AIRZ